# Altium schematic sheet MAGI'sBuckPower-TEST - 副本.SchDoc
size A4
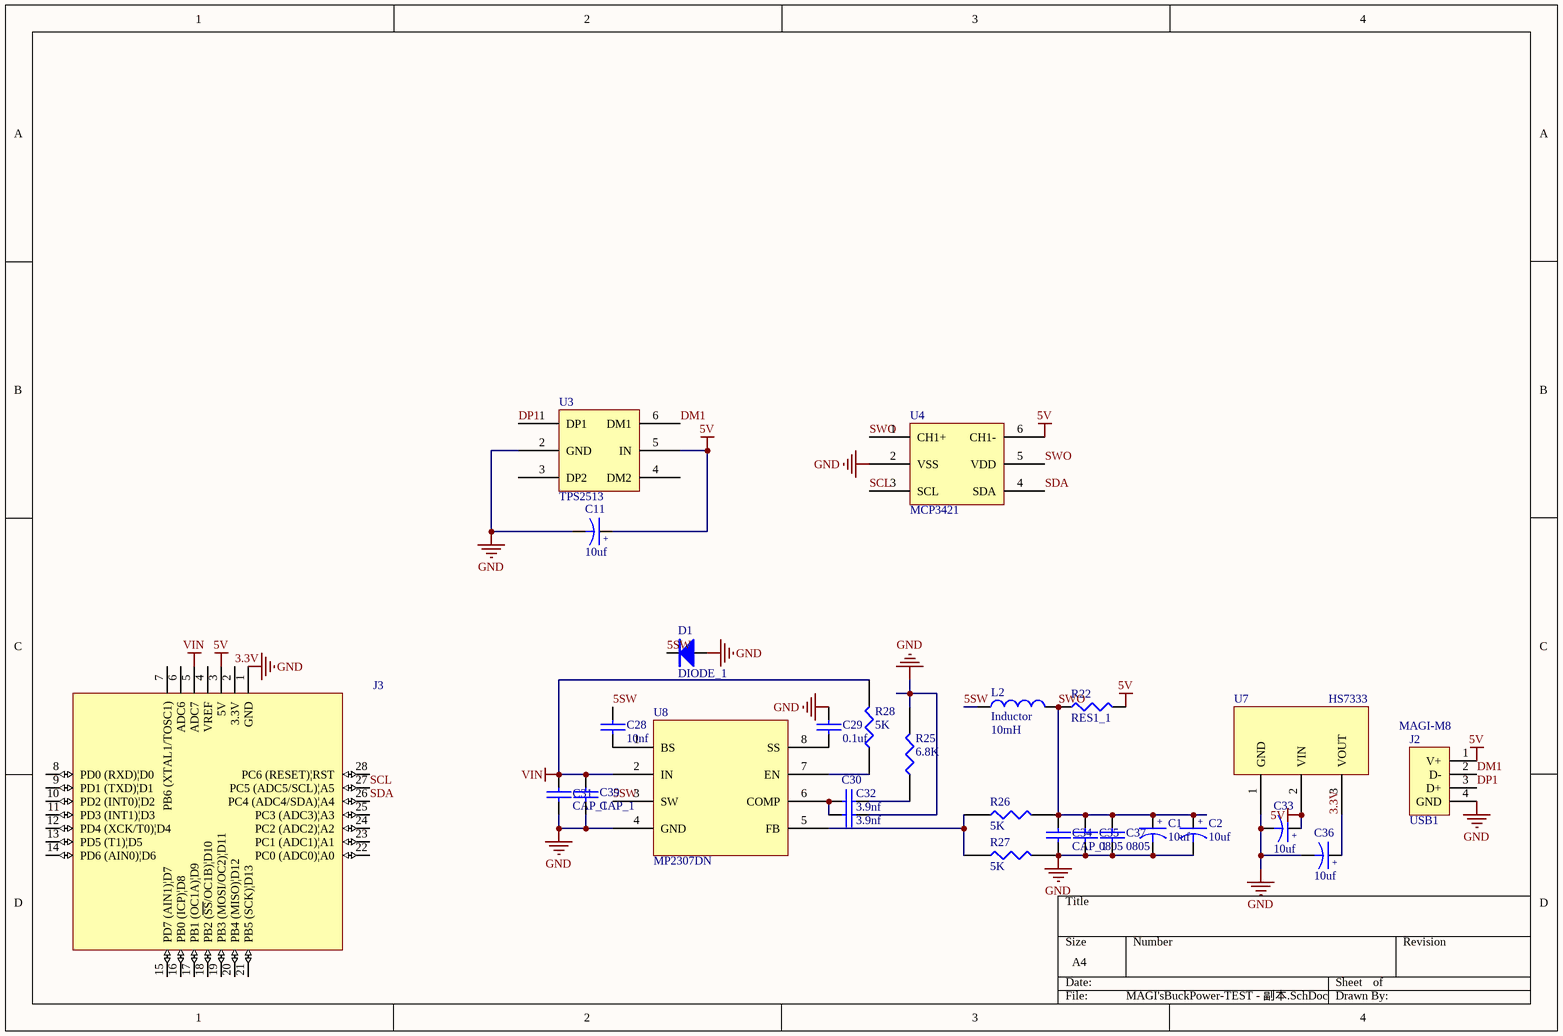
[diagram p0: MAGI'sBuckPower-TEST - 副本.SchDoc]

## Parts
C1  10uf  [C1210_N]
C2  10uf  [C1210_N]
C11  10uf  [6-0805_N]
C28  10nf  [6-0805_N]
C29  0.1uf  [6-0805_N]
C30  3.9nf  [6-0805_N]
C31  CAP_1  [C1206]
C32  3.9nf  [6-0805_N]
C33  10uf  [6-0805_N]
C34  CAP_1  [6TPE330M]
C35  0805  [6-0805_N]
C36  10uf  [6-0805_N]
C37  0805  [6-0805_N]
C39  CAP_1  [C1206]
D1  DIODE_1  [SMA]
J2  USB1  [USB-04A]
J3  MAGI-M8  [MAGIsBoard]
L2  Inductor  value 10mH  [7*7]
R22  RES1_1  [2512]
R25  6.8K  [6-0805_N]
R26  5K  [6-0805_N]
R27  5K  [6-0805_N]
R28  5K  [6-0805_N]
U3  TPS2513  [TPS2513]
U4  MCP3421  [tps2513]
U7  HS7333  [HS7333]
U8  MP2307DN  [MP2307DN]

## Nets
5V: C11.1 C33.1 J2.1(V+) J3.3(5V) R22.2 U3.5(IN) U4.6(CH1-) U7.2(VIN)
GND: C1.2 C2.2 C11.2 C29.1 C31.2 C32.2 C33.2 C34.2 C35.2 C36.2 C37.2 C39.2 D1.2(A) J2.4(GND) J3.1(GND) R25.2 R27.2 U3.2(GND) U4.2(VSS) U7.1(GND) U8.4(GND)
VIN: C31.1 C39.1 J3.5(ADC7) R28.2 U8.2(IN)
3.3V: C36.1 J3.2(3.3V) U7.3(VOUT)
5SW: C28.1 D1.1(K) L2.1 U8.3(SW)
DM1: J2.2(D-) U3.6(DM1)
DP1: J2.3(D+) U3.1(DP1)
SCL: J3.27(PC5_(ADC5/SCL)|A5) U4.3(SCL)
SDA: J3.26(PC4_(ADC4/SDA)|A4) U4.4(SDA)
SWO: C1.1 C2.1 C34.1 C35.1 C37.1 L2.2 R22.1 R26.2 U4.1(CH1+) U4.5(VDD)
NetC28_2: C28.2 U8.1(BS)
NetC29_2: C29.2 U8.8(SS)
NetC30_1: C30.1 C32.1 U8.6(COMP)
NetC30_2: C30.2 R25.1
NetR26_1: R26.1 R27.1 U8.5(FB)
NetR28_1: R28.1 U8.7(EN)

Not connected (* = marked no-connect by the designer): J3 4(VREF) 6(ADC6) 7(PB6_(XTAL1/TOSC1)) 8(PD0_(RXD)|D0) 9(PD1_(TXD)|D1) 10(PD2_(INT0)|D2) 11(PD3_(INT1)|D3) 12(PD4_(XCK/T0)|D4) 13(PD5_(T1)|D5) 14(PD6_(AIN0)|D6) 15(PD7_(AIN1)|D7) 16(PB0_(ICP)|D8) 17(PB1_(OC1A)|D9) 18(PB2_(~{SS}/OC1B)|D10) 19(PB3_(MOSI/OC2)|D11) 20(PB4_(MISO)|D12) 21(PB5_(SCK)|D13) 22(PC0_(ADC0)|A0) 23(PC1_(ADC1)|A1) 24(PC2_(ADC2)|A2) 25(PC3_(ADC3)|A3) 28(PC6_(RESET)|RST); U3 3(DP2) 4(DM2)

## Notes on the sheet
- (in symbol CAPACITOR POL) +

## Library data of the parts
C1 C2 C11 C33 C36 = CAPACITOR POL: Capacitor
C28-C32 C34 C35 C37 C39 = CAP_1: Capacitor
D1 = DIODE_1: Diode
L2 = Inductor: Code_IEC: 1005; Published: 8-Jun-2000; LatestRevisionDate: 29-May-2009; LatestRevisionNote: IPC-7351 Footprint Added.; PackageReference: 0402-A; Publisher: Altium Limited; PackageDescription: Chip Inductor; Code_JEITA: 0402
R25-R28 = RES1